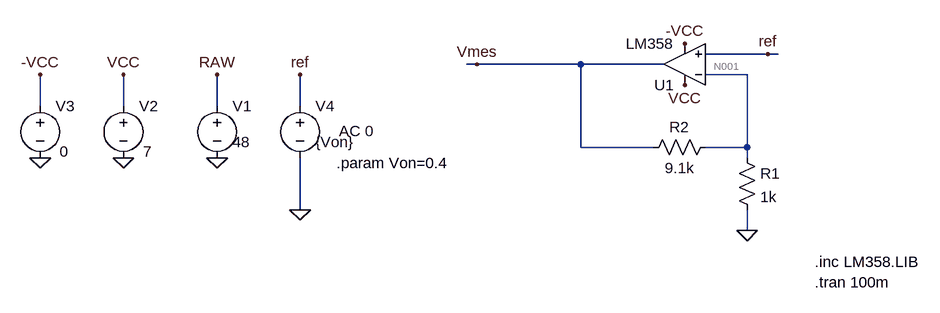
[diagram p0: schematic current-sense-multiplier.asc]
current-sense-multiplier.asc, the LTspice schematic file:
Version 4
SHEET 1 880 680
WIRE 448 32 352 32
WIRE 464 32 448 32
WIRE 0 48 -16 48
WIRE 160 48 0 48
WIRE 288 48 160 48
WIRE 416 64 352 64
WIRE -672 112 -672 64
WIRE -544 112 -544 64
WIRE -400 112 -400 64
WIRE -272 112 -272 64
WIRE 160 176 160 48
WIRE 272 176 160 176
WIRE 416 176 416 64
WIRE 416 176 352 176
WIRE 416 192 416 176
WIRE -272 272 -272 192
WIRE 416 304 416 272
FLAG 320 80 VCC
FLAG 320 16 -VCC
FLAG 416 304 0
FLAG 0 48 Vmes
FLAG 448 32 ref
FLAG -400 192 0
FLAG -400 64 RAW
FLAG -544 192 0
FLAG -544 64 VCC
FLAG -672 192 0
FLAG -672 64 -VCC
FLAG -272 272 0
FLAG -272 64 ref
SYMBOL OpAmps\\opamp2 320 112 R180
SYMATTR InstName U1
SYMATTR Value LM358
SYMBOL res 400 176 R0
SYMATTR InstName R1
SYMATTR Value 1k
SYMBOL res 368 160 R90
WINDOW 0 0 56 VBottom 2
WINDOW 3 32 56 VTop 2
SYMATTR InstName R2
SYMATTR Value 9.1k
SYMBOL voltage -400 96 R0
WINDOW 123 24 44 Left 2
WINDOW 39 0 0 Left 0
WINDOW 3 24 72 Left 2
SYMATTR Value 48
SYMATTR InstName V1
SYMBOL voltage -544 96 R0
WINDOW 123 24 44 Left 2
WINDOW 39 0 0 Left 0
WINDOW 3 30 86 Left 2
SYMATTR Value 7
SYMATTR InstName V2
SYMBOL voltage -672 96 R0
WINDOW 123 24 44 Left 2
WINDOW 39 0 0 Left 0
WINDOW 3 30 86 Left 2
SYMATTR Value 0
SYMATTR InstName V3
SYMBOL voltage -272 96 R0
WINDOW 123 60 55 Left 2
WINDOW 39 0 0 Left 0
WINDOW 3 24 72 Left 2
SYMATTR Value2 AC 0
SYMATTR Value {Von}
SYMATTR InstName V4
TEXT -216 200 Left 2 !.param Von=0.4
TEXT 520 352 Left 2 !.inc LM358.LIB
TEXT 520 384 Left 2 !.tran 100m

The netlist it stands for:
* current-sense-multiplier.asc
XU1 ref N001 VCC -VCC Vmes LM358  ; pins In+ In- V+ V- OUT
R1 N001 0 1k
R2 N001 Vmes 9.1k
V1 RAW 0 48
V2 VCC 0 7
V3 -VCC 0 0
V4 ref 0 {Von} AC 0
.param Von=0.4
.inc LM358.LIB
.tran 100m
.backanno
.end

* Results of the author's LTspice run, read from the files saved beside the schematic
* Operating Point, zero values left out:
*   V(vmes) = 4.041 V
*   V(vcc) = 7 V
*   V(n001) = 400.2 mV
*   V(ref) = 400 mV
*   V(raw) = 48 V
*   I(R1) = 400.2 µA
*   I(R2) = -400.1 µA
*   I(V2) = -700.1 µA
*   I(V3) = 300 µA
*   I(V4) = 10 nA
*   Ix(u1:IN+) = -10 nA
*   Ix(u1:IN-) = -9.503 nA
*   Ix(u1:VCC) = 700.1 µA
*   Ix(u1:VEE) = -300 µA
*   Ix(u1:OUT) = -400.1 µA